# Altium schematic sheet eight-channel-ina2128-afe.SchDoc
size A2
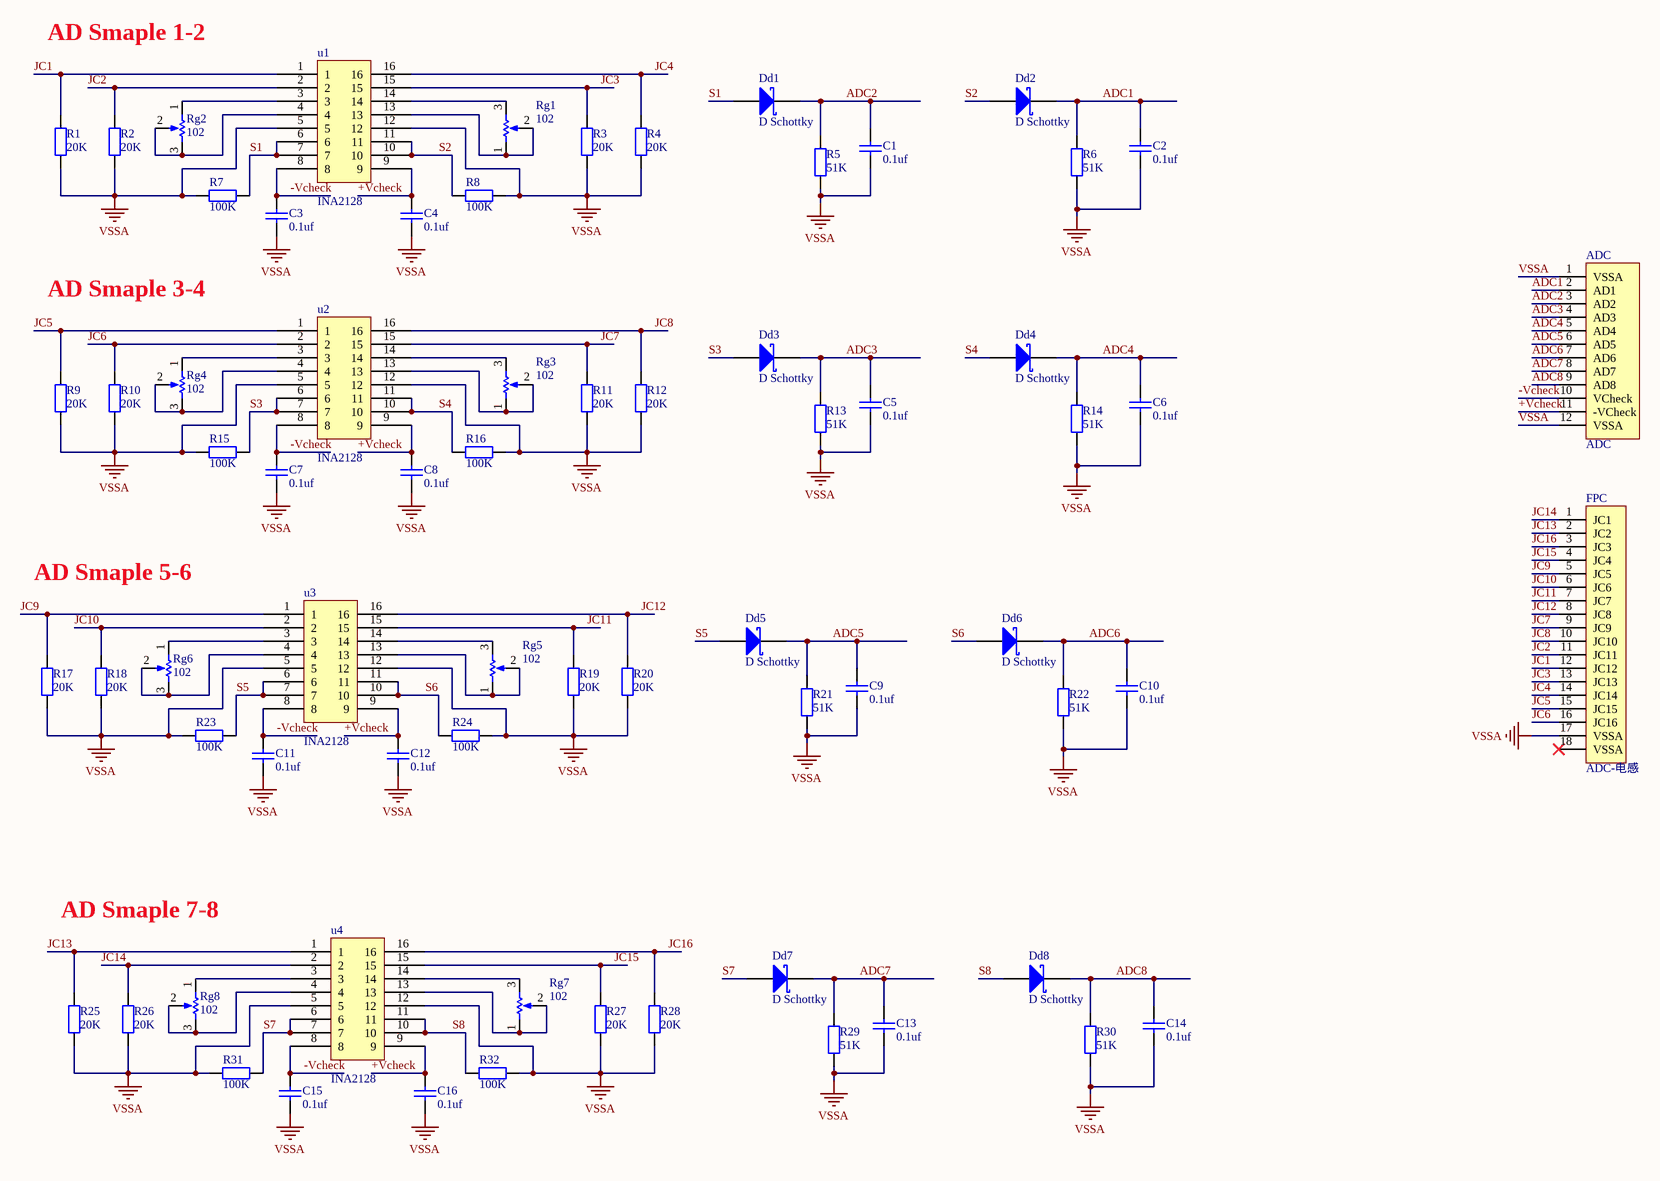
[diagram p0: eight-channel-ina2128-afe.SchDoc]

## Parts
ADC  ADC  [FPC0.5 2H-WS-12P]
C1  0.1uf  [LC-0603_C]
C2  0.1uf  [LC-0603_C]
C3  0.1uf  [LC-0603_C]
C4  0.1uf  [LC-0603_C]
C5  0.1uf  [LC-0603_C]
C6  0.1uf  [LC-0603_C]
C7  0.1uf  [LC-0603_C]
C8  0.1uf  [LC-0603_C]
C9  0.1uf  [LC-0603_C]
C10  0.1uf  [LC-0603_C]
C11  0.1uf  [LC-0603_C]
C12  0.1uf  [LC-0603_C]
C13  0.1uf  [LC-0603_C]
C14  0.1uf  [LC-0603_C]
C15  0.1uf  [LC-0603_C]
C16  0.1uf  [LC-0603_C]
Dd1  D Schottky  [SOD-323]
Dd2  D Schottky  [SOD-323]
Dd3  D Schottky  [SOD-323]
Dd4  D Schottky  [SOD-323]
Dd5  D Schottky  [SOD-323]
Dd6  D Schottky  [SOD-323]
Dd7  D Schottky  [SOD-323]
Dd8  D Schottky  [SOD-323]
FPC  ADC-电感  [fpc_0.5_16pin]
R1  20k  [LC-0603_R]
R2  20k  [LC-0603_R]
R3  20k  [LC-0603_R]
R4  20k  [LC-0603_R]
R5  value 51K  [LC-0603_R]  (hidden comment: 20k)
R6  value 51K  [LC-0603_R]  (hidden comment: 20k)
R7  100k  [LC-0603_R]
R8  100k  [LC-0603_R]
R9  20k  [LC-0603_R]
R10  20k  [LC-0603_R]
R11  20k  [LC-0603_R]
R12  20k  [LC-0603_R]
R13  value 51K  [LC-0603_R]  (hidden comment: 20k)
R14  value 51K  [LC-0603_R]  (hidden comment: 20k)
R15  100k  [LC-0603_R]
R16  100k  [LC-0603_R]
R17  20k  [LC-0603_R]
R18  20k  [LC-0603_R]
R19  20k  [LC-0603_R]
R20  20k  [LC-0603_R]
R21  value 51K  [LC-0603_R]  (hidden comment: 20k)
R22  value 51K  [LC-0603_R]  (hidden comment: 20k)
R23  100k  [LC-0603_R]
R24  100k  [LC-0603_R]
R25  20k  [LC-0603_R]
R26  20k  [LC-0603_R]
R27  20k  [LC-0603_R]
R28  20k  [LC-0603_R]
R29  value 51K  [LC-0603_R]  (hidden comment: 20k)
R30  value 51K  [LC-0603_R]  (hidden comment: 20k)
R31  100k  [LC-0603_R]
R32  100k  [LC-0603_R]
Rg1  102  [精密电位器]
Rg2  102  [精密电位器]
Rg3  102  [精密电位器]
Rg4  102  [精密电位器]
Rg5  102  [精密电位器]
Rg6  102  [精密电位器]
Rg7  102  [精密电位器]
Rg8  102  [精密电位器]
u1  INA2128  [INA2128]
u2  INA2128  [INA2128]
u3  INA2128  [INA2128]
u4  INA2128  [INA2128]

## Nets
VSSA: ADC.1(VSSA) ADC.12(VSSA) C1.1 C2.1 C3.1 C4.1 C5.1 C6.1 C7.1 C8.1 C9.1 C10.1 C11.1 C12.1 C13.1 C14.1 C15.1 C16.1 FPC.17(VSSA) R1.2 R2.2 R3.2 R4.2 R5.2 R6.2 R7.2 R8.1 R9.2 R10.2 R11.2 R12.2 R13.2 R14.2 R15.2 R16.1 R17.2 R18.2 R19.2 R20.2 R21.2 R22.2 R23.2 R24.1 R25.2 R26.2 R27.2 R28.2 R29.2 R30.2 R31.2 R32.1 u1.5 u1.12 u2.5 u2.12 u3.5 u3.12 u4.5 u4.12
+Vcheck: ADC.11(-VCheck) C4.2 C8.2 C12.2 C16.2 u1.9 u2.9 u3.9 u4.9
-Vcheck: ADC.10(VCheck) C3.2 C7.2 C11.2 C15.2 u1.8 u2.8 u3.8 u4.8
ADC1: ADC.2(AD1) C2.2 Dd2.2(K) R6.1
ADC2: ADC.3(AD2) C1.2 Dd1.2(K) R5.1
ADC3: ADC.4(AD3) C5.2 Dd3.2(K) R13.1
ADC4: ADC.5(AD4) C6.2 Dd4.2(K) R14.1
ADC5: ADC.6(AD5) C9.2 Dd5.2(K) R21.1
ADC6: ADC.7(AD6) C10.2 Dd6.2(K) R22.1
ADC7: ADC.8(AD7) C13.2 Dd7.2(K) R29.1
ADC8: ADC.9(AD8) C14.2 Dd8.2(K) R30.1
JC1: FPC.12(JC12) R1.1 u1.1
JC2: FPC.11(JC11) R2.1 u1.2
JC3: FPC.13(JC13) R3.1 u1.15
JC4: FPC.14(JC14) R4.1 u1.16
JC5: FPC.15(JC15) R9.1 u2.1
JC6: FPC.16(JC16) R10.1 u2.2
JC7: FPC.9(JC9) R11.1 u2.15
JC8: FPC.10(JC10) R12.1 u2.16
JC9: FPC.5(JC5) R17.1 u3.1
JC10: FPC.6(JC6) R18.1 u3.2
JC11: FPC.7(JC7) R19.1 u3.15
JC12: FPC.8(JC8) R20.1 u3.16
JC13: FPC.2(JC2) R25.1 u4.1
JC14: FPC.1(JC1) R26.1 u4.2
JC15: FPC.4(JC4) R27.1 u4.15
JC16: FPC.3(JC3) R28.1 u4.16
S1: Dd1.1(A) R7.1 u1.6 u1.7
S2: Dd2.1(A) R8.2 u1.10 u1.11
S3: Dd3.1(A) R15.1 u2.6 u2.7
S4: Dd4.1(A) R16.2 u2.10 u2.11
S5: Dd5.1(A) R23.1 u3.6 u3.7
S6: Dd6.1(A) R24.2 u3.10 u3.11
S7: Dd7.1(A) R31.1 u4.6 u4.7
S8: Dd8.1(A) R32.2 u4.10 u4.11
NetRg1_1: Rg1.1(TOP) Rg1.2(TAP) u1.13
NetRg1_3: Rg1.3(BOT) u1.14
NetRg2_1: Rg2.1(TOP) u1.3
NetRg2_2: Rg2.2(TAP) Rg2.3(BOT) u1.4
NetRg3_1: Rg3.1(TOP) Rg3.2(TAP) u2.13
NetRg3_3: Rg3.3(BOT) u2.14
NetRg4_1: Rg4.1(TOP) u2.3
NetRg4_2: Rg4.2(TAP) Rg4.3(BOT) u2.4
NetRg5_1: Rg5.1(TOP) Rg5.2(TAP) u3.13
NetRg5_3: Rg5.3(BOT) u3.14
NetRg6_1: Rg6.1(TOP) u3.3
NetRg6_2: Rg6.2(TAP) Rg6.3(BOT) u3.4
NetRg7_1: Rg7.1(TOP) Rg7.2(TAP) u4.13
NetRg7_3: Rg7.3(BOT) u4.14
NetRg8_1: Rg8.1(TOP) u4.3
NetRg8_2: Rg8.2(TAP) Rg8.3(BOT) u4.4

Not connected (* = marked no-connect by the designer): FPC 18(VSSA)*

## Notes on the sheet
- AD Smaple 1-2
- AD Smaple 3-4
- AD Smaple 5-6
- AD Smaple 7-8

## Library data of the parts
C1-C16 = Cap
Dd1-Dd8 = D Schottky: Schottky Diode; Published: 8-Jun-2000; LatestRevisionDate: 17-Jul-2002; LatestRevisionNote: Re-released for DXP Platform.; PackageReference: SMB; Publisher: Altium Limited; PackageDescription: DO-214-AA/SMB; 2 C-Bend Leads; Body 5.3 x 3.6 mm, inc. leads (LxW); Code_JEDEC: DO-214-AA
R1-R32 = Res: Resistor; Published: 8-Jun-2000; LatestRevisionDate: 17-Jul-2002; LatestRevisionNote: Re-released for DXP Platform.; PackageReference: AXIAL-0.4; Publisher: Altium Limited
  R1-R4 R9-R12 R17-R20 R25-R28: Value: 20K
  R7 R8 R15 R16 R23 R24 R31 R32: Value: 100K
Rg1-Rg8 = RPot: Potentiometer; Sim Note: Enter the Resistance value and the set point into parameter fields.; Set Position: 0.5; Value: 1K; Published: 8-Jun-2000; LatestRevisionDate: 17-Jul-2002; LatestRevisionNote: Re-released for DXP Platform.; PackageReference: VR5; Publisher: Altium Limited